# EAGLE schematic nRF8001_schematic (EAGLE 6.6.0)
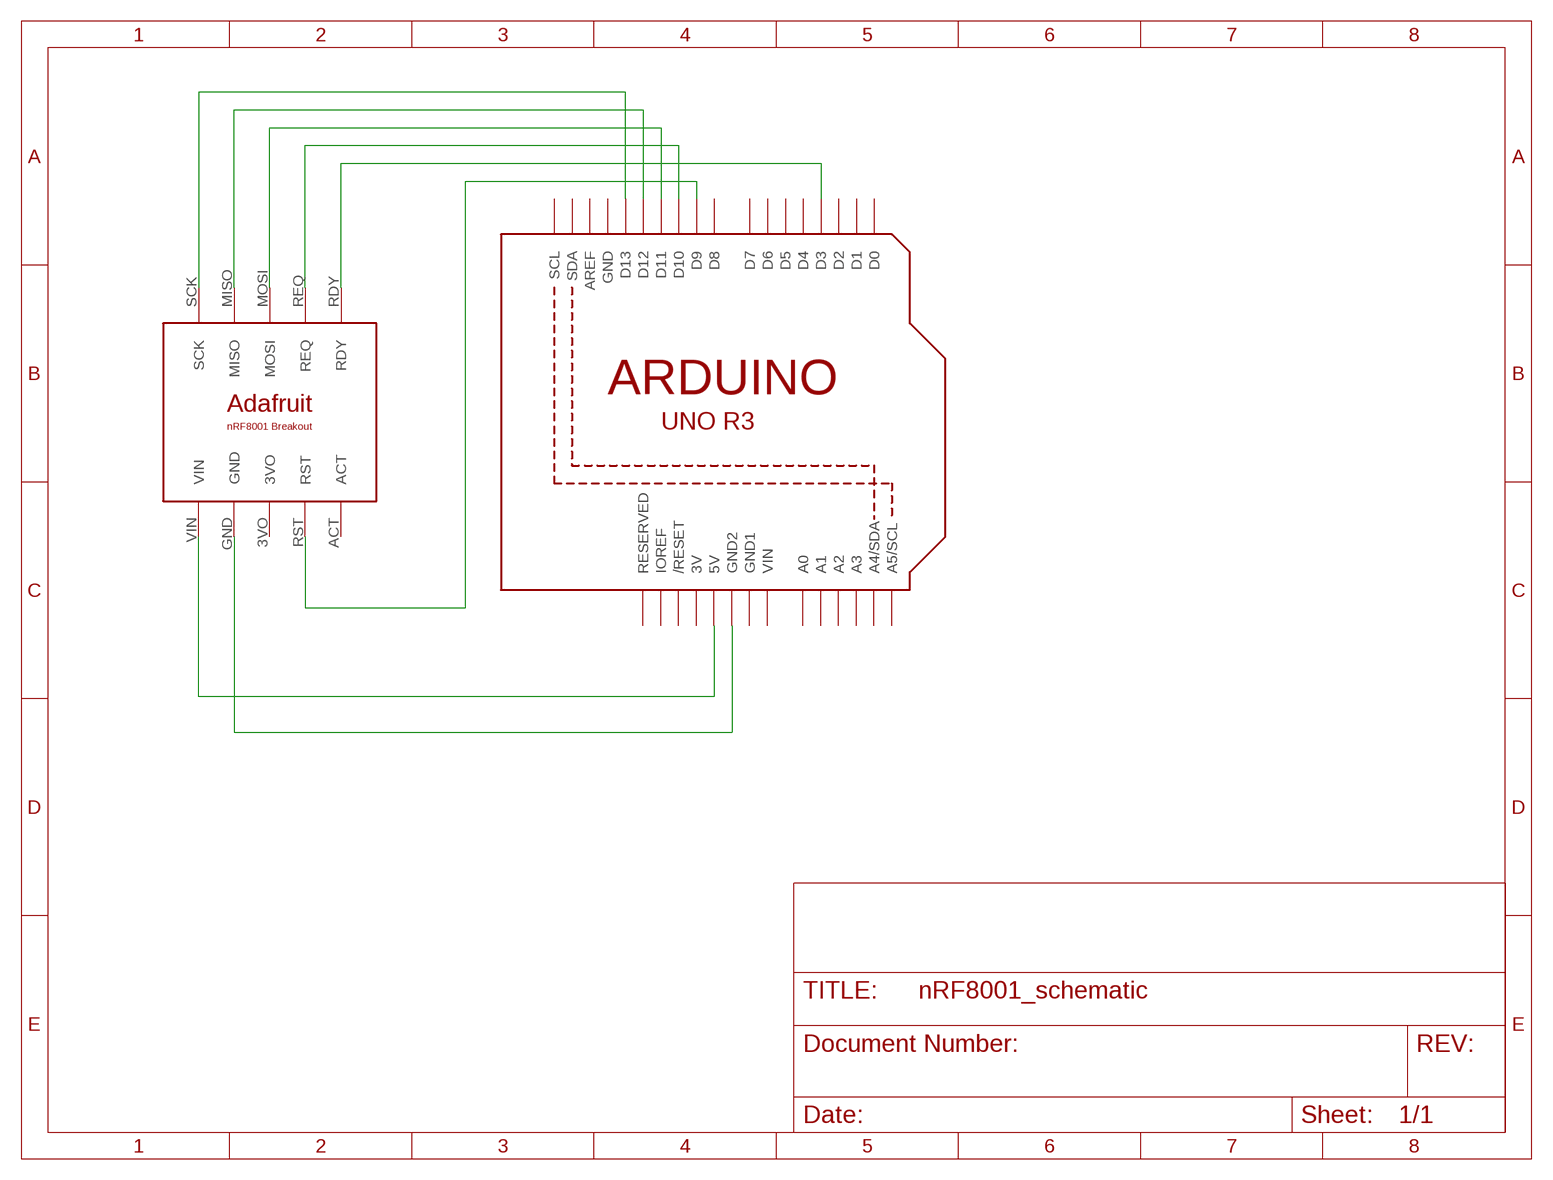
[diagram p0: schematic, sheet 1]

## Parts
U1  ARDUINOR3-DIMENSION  [ARDUINOR3]
U$1  ADAFRUIT_NRF8001_BREAKOUT  [ADAFRUIT_NRF8001_BREAKOUT_HEADERS]

## Nets
N$5: U1.D13 U$1.SCK
N$6: U1.D12 U$1.MISO
N$7: U1.D11 U$1.MOSI
N$8: U1.D10 U$1.REQ
N$9: U1.D3 U$1.RDY
N$10: U1.D9 U$1.RST
N$16: U1.GND2 U$1.GND
VDD: U1.5V U$1.VIN
Unconnected: U1.A0 U1.A1 U1.A2 U1.A3 U1.A4(A4/SDA) U1.A5(A5/SCL) U1.AREF U1.D0 U1.D1 U1.D2 U1.D4 U1.D5 U1.D6 U1.D7 U1.D8 U1.IOREF U1.RESERVED U1.RESET(/RESET) U1.SCL U1.SDA U$1.3VO U$1.ACT

## Power pins joined to a net without a drawn wire
3V: U1.3V
GND: U1.GND
GND1: U1.GND1
VIN: U1.VIN

## Library data of the parts
U1 = adafruit:ARDUINOR3: This is a new object for the new Arduino R3 - with extra pins that you may want to use (such as IOref, and duplicated A4/A5
U$1 = parts:ADAFRUIT_NRF8001_BREAKOUT